# Altium schematic sheet core.SchDoc
size A4; SheetNumber: 2; SheetTotal: 6
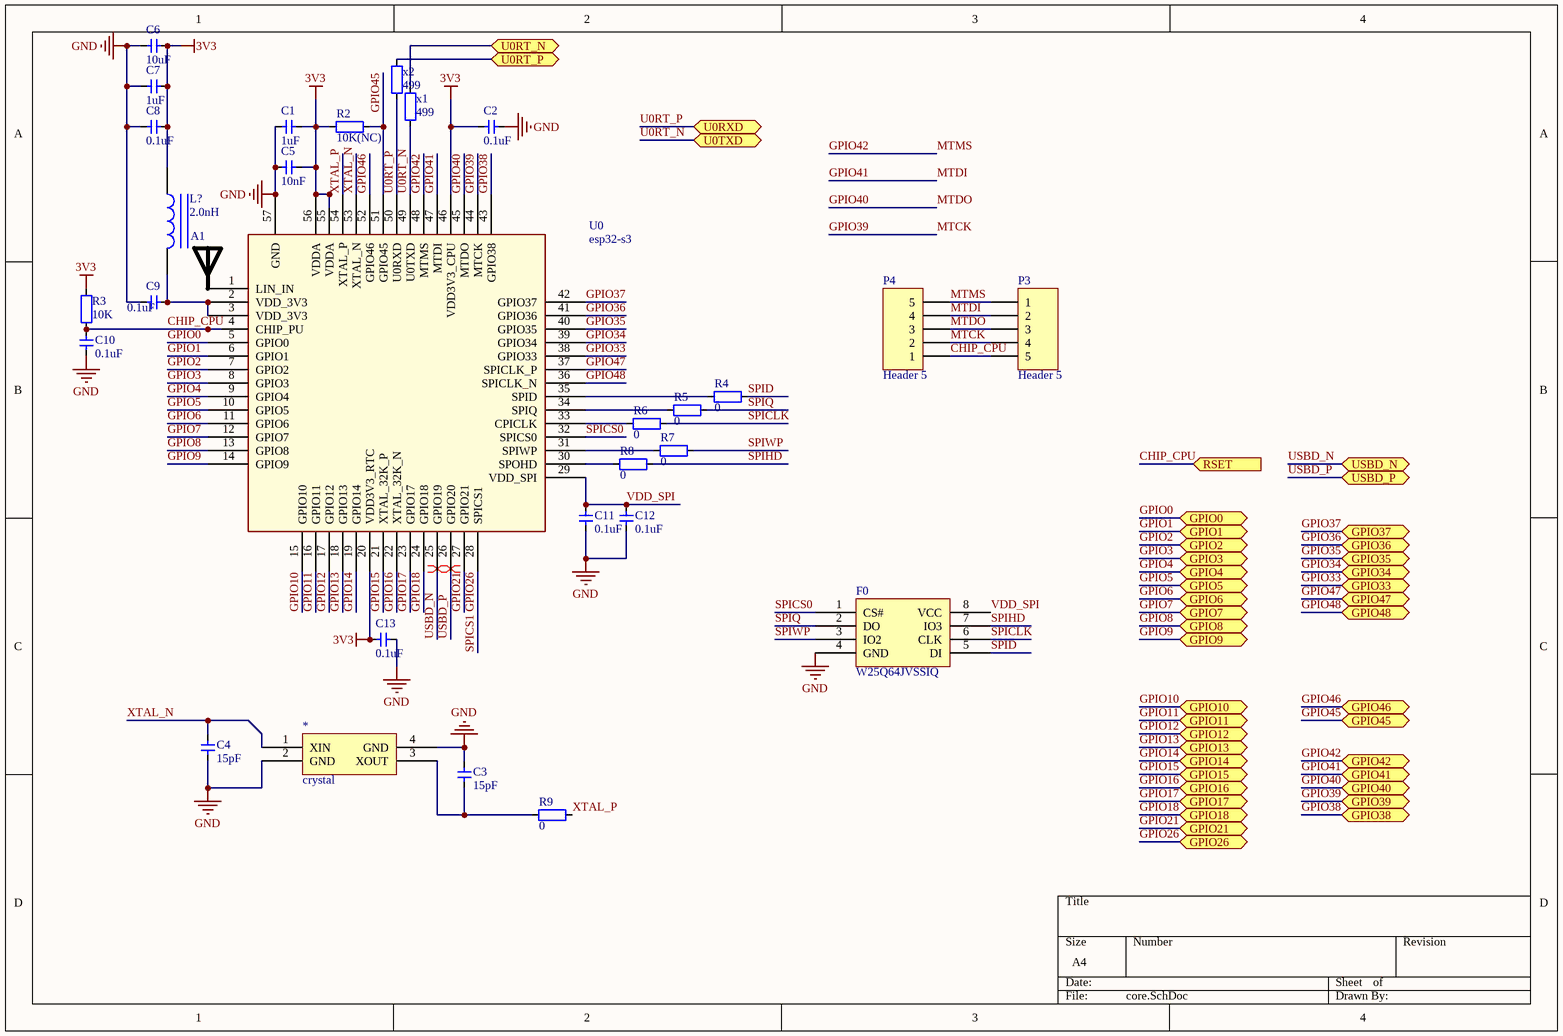
[diagram p0: core.SchDoc]

## Parts
*  crystal  [无源晶振]
A1  RAINSUN  [ANT-Rainsun-AN5120]  (value not drawn)
C1  1uF  [CAP_0402]
C2  0.1uF  [CAP_0402]
C3  15pF  [CAP_0402]
C4  15pF  [CAP_0402]
C5  10nF  [CAP_0402]
C6  10uF  [CAP_0402]
C7  1uF  [CAP_0402]
C8  0.1uF  [CAP_0402]
C9  0.1uF  [CAP_0402]
C10  0.1uF  [CAP_0402]
C11  0.1uF  [CAP_0402]
C12  0.1uF  [CAP_0402]
C13  0.1uF  [CAP_0402]
F0  W25Q64JVSSIQ  [W25Q64JVSSIQ]
L?  2.0nH  [LC-0402_L]
P3  Header 5  [HDR1X5]
P4  Header 5  [HDR1X5]
R2  10K(NC)  [RES_0402]
R3  10K  [RES_0402]
R4  0  [RES_0402]
R5  0  [RES_0402]
R6  0  [RES_0402]
R7  0  [RES_0402]
R8  0  [RES_0402]
R9  0  [RES_0402]
U0  esp32-s3  [esp32-s3]
x1  499  [RES_0402]
x2  499  [RES_0402]

## Ports
GPIO0 (bidir), GPIO1 (bidir), GPIO2 (bidir), GPIO3 (bidir), GPIO4 (bidir), GPIO5 (bidir), GPIO6 (bidir), GPIO7 (bidir), GPIO8 (bidir), GPIO9 (bidir), GPIO10 (bidir), GPIO11 (bidir), GPIO12 (bidir), GPIO13 (bidir), GPIO14 (bidir), GPIO15 (bidir), GPIO16 (bidir), GPIO17 (bidir), GPIO18 (bidir), GPIO21 (bidir), GPIO26 (bidir), GPIO33 (bidir), GPIO34 (bidir), GPIO35 (bidir), GPIO36 (bidir), GPIO37 (bidir), GPIO38 (bidir), GPIO39 (bidir), GPIO40 (bidir), GPIO41 (bidir), GPIO42 (bidir), GPIO45 (bidir), GPIO46 (bidir), GPIO47 (bidir), GPIO48 (bidir), RSET (in), U0RT_N (bidir), U0RT_P (bidir), U0RXD (bidir), U0TXD (bidir), USBD_N (bidir), USBD_P (bidir)

## Nets
3V3: C1.2 C2.2 C5.2 C6.2 C7.2 C8.2 C13.2 L?.1 R2.2 R3.1 U0.20(VDD3V3_RTC) U0.46(VDD3V3_CPU) U0.55(VDDA) U0.56(VDDA)
GND: *.2(GND) *.4(GND) C1.1 C2.1 C3.1 C4.1 C5.1 C6.1 C7.1 C8.1 C9.1 C10.2 C11.1 C12.1 C13.1 F0.4(GND) U0.57(GND)
CHIP_CPU: C10.1 P3.5 P4.1 R3.2 U0.4(CHIP_PU) ; port RSET
GPIO0: U0.5(GPIO0) ; port GPIO0
GPIO1: U0.6(GPIO1) ; port GPIO1
GPIO2: U0.7(GPIO2) ; port GPIO2
GPIO3: U0.8(GPIO3) ; port GPIO3
GPIO4: U0.9(GPIO4) ; port GPIO4
GPIO5: U0.10(GPIO5) ; port GPIO5
GPIO6: U0.11(GPIO6) ; port GPIO6
GPIO7: U0.12(GPIO7) ; port GPIO7
GPIO8: U0.13(GPIO8) ; port GPIO8
GPIO9: U0.14(GPIO9) ; port GPIO9
GPIO10: U0.15(GPIO10) ; port GPIO10
GPIO11: U0.16(GPIO11) ; port GPIO11
GPIO12: U0.17(GPIO12) ; port GPIO12
GPIO13: U0.18(GPIO13) ; port GPIO13
GPIO14: U0.19(GPIO14) ; port GPIO14
GPIO15: U0.21(XTAL_32K_P) ; port GPIO15
GPIO16: U0.22(XTAL_32K_N) ; port GPIO16
GPIO17: U0.23(GPIO17) ; port GPIO17
GPIO18: U0.24(GPIO18) ; port GPIO18
GPIO21: U0.27(GPIO21) ; port GPIO21
GPIO26: U0.28(SPICS1) ; port GPIO26  [also labelled SPICS1]
GPIO33: U0.38(GPIO33) ; port GPIO33
GPIO34: U0.39(GPIO34) ; port GPIO34
GPIO35: U0.40(GPIO35) ; port GPIO35
GPIO36: U0.41(GPIO36) ; port GPIO36
GPIO37: U0.42(GPIO37) ; port GPIO37
GPIO38: U0.43(GPIO38) ; port GPIO38
GPIO39: P3.4 P4.2 U0.44(MTCK) ; port GPIO39  [also labelled MTCK]
GPIO40: P3.3 P4.3 U0.45(MTDO) ; port GPIO40  [also labelled MTDO]
GPIO41: P3.2 P4.4 U0.47(MTDI) ; port GPIO41  [also labelled MTDI]
GPIO42: P3.1 P4.5 U0.48(MTMS) ; port GPIO42  [also labelled MTMS]
GPIO45: R2.1 U0.51(GPIO45) ; port GPIO45
GPIO46: U0.52(GPIO46) ; port GPIO46
GPIO47: U0.37(SPICLK_P) ; port GPIO47
GPIO48: U0.36(SPICLK_N) ; port GPIO48
SPICLK: F0.6(CLK) R6.1
SPICS0: F0.1(CS#) U0.32(SPICS0)
SPID: F0.5(DI) R4.1
SPIHD: F0.7(IO3) R8.1
SPIQ: F0.2(DO) R5.1
SPIWP: F0.3(IO2) R7.1
U0RT_N: U0.49(U0TXD) x1.2 ; port U0TXD
U0RT_N: x1.1 ; port U0RT_N  [a separate net that carries the same name]
U0RT_P: U0.50(U0RXD) x2.2 ; port U0RXD
U0RT_P: x2.1 ; port U0RT_P  [a separate net that carries the same name]
USBD_N: U0.25(GPIO19) ; port USBD_N
USBD_P: U0.26(GPIO20) ; port USBD_P
VDD_SPI: C11.2 C12.2 F0.8(VCC) U0.29(VDD_SPI)
XTAL_N: *.1(XIN) C4.2 U0.53(XTAL_N)
XTAL_P: R9.1 U0.54(XTAL_P)
Net*_3: *.3(XOUT) C3.2 R9.2
NetA1_1: A1.1 U0.1(LIN_IN)
NetC9_2: C9.2 L?.2 U0.2(VDD_3V3) U0.3(VDD_3V3)
NetR4_2: R4.2 U0.35(SPID)
NetR5_2: R5.2 U0.34(SPIQ)
NetR6_2: R6.2 U0.33(CPICLK)
NetR7_2: R7.2 U0.31(SPIWP)
NetR8_2: R8.2 U0.30(SPOHD)

## Layout directives
differential pair: USBD_N, USBD_P

## Library data of the parts
A1 = ANT-Rainsun-AP5120
C1-C13 = 电容-0402: Capacitor; Value: 0.1u
L? = 0402 2.7nH 0.3nH: 贴片电感; ComponentLink1Description: 供应商链接; ComponentLink1URL: http://www.szlcsc.com/product/details_27872.html; Package: 0402; Supplier: LC; SuppliersPartNumber: C27123
P3 P4 = Header 5: Header, 5-Pin; LatestRevisionDate: 17-Jul-2002; LatestRevisionNote: Re-released for DXP Platform.; Publisher: Altium Limited
R2-R9 x1 x2 = 电阻-0402: Resistor; Value: 22R